# Altium schematic sheet MSP430.SchDoc
size A
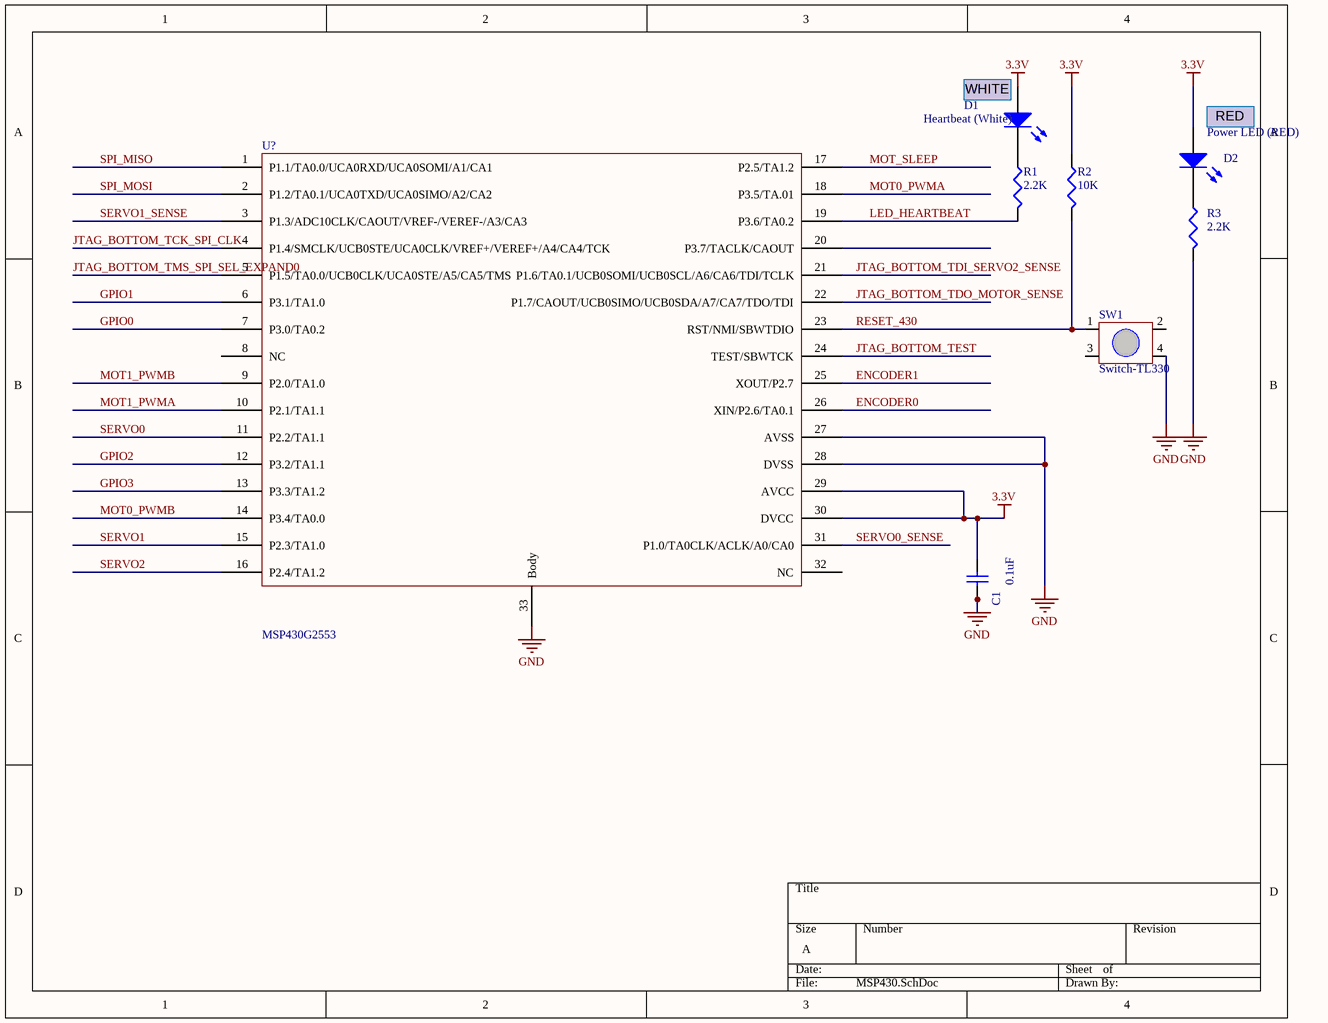
[diagram p0: MSP430.SchDoc]

## Parts
C1  value 0.1uF  [CAPC1005L]  (hidden comment: Cap Semi)
D1  Heartbeat (White)  [SurfaceMount(603)]
D2  Power LED (RED)  [SurfaceMount(603)]
R1  value 2.2K  [J1-0603]  (hidden comment: DiodeRes)
R2  value 10K  [J1-0603]  (hidden comment: ResetRes)
R3  value 2.2K  [J1-0603]  (hidden comment: DiodeRes)
SW1  Switch-TL330  [SwitchTall-TL330]
U?  MSP430G2553  [QFN-32]

## Nets
3.3V: C1.2 D1.1(A) D2.1(A) R2.1 U?.29(AVCC) U?.30(DVCC)
GND: C1.1 R3.2 SW1.4 U?.27(AVSS) U?.28(DVSS) U?.33(Body)
ENCODER0: U?.26(XIN/P2.6/TA0.1)
ENCODER1: U?.25(XOUT/P2.7)
GPIO0: U?.7(P3.0/TA0.2)
GPIO1: U?.6(P3.1/TA1.0)
GPIO2: U?.12(P3.2/TA1.1)
GPIO3: U?.13(P3.3/TA1.2)
JTAG_BOTTOM_TCK_SPI_CLK: U?.4(P1.4/SMCLK/UCB0STE/UCA0CLK/VREF+/VEREF+/A4/CA4/TCK)
JTAG_BOTTOM_TDI_SERVO2_SENSE: U?.21(P1.6/TA0.1/UCB0SOMI/UCB0SCL/A6/CA6/TDI/TCLK)
JTAG_BOTTOM_TDO_MOTOR_SENSE: U?.22(P1.7/CAOUT/UCB0SIMO/UCB0SDA/A7/CA7/TDO/TDI)
JTAG_BOTTOM_TEST: U?.24(TEST/SBWTCK)
JTAG_BOTTOM_TMS_SPI_SEL_EXPAND0: U?.5(P1.5/TA0.0/UCB0CLK/UCA0STE/A5/CA5/TMS)
LED_HEARTBEAT: R1.2 U?.19(P3.6/TA0.2)
MOT0_PWMA: U?.18(P3.5/TA.01)
MOT0_PWMB: U?.14(P3.4/TA0.0)
MOT1_PWMA: U?.10(P2.1/TA1.1)
MOT1_PWMB: U?.9(P2.0/TA1.0)
MOT_SLEEP: U?.17(P2.5/TA1.2)
RESET_430: R2.2 SW1.1 U?.23(RST/NMI/SBWTDIO)
SERVO0: U?.11(P2.2/TA1.1)
SERVO0_SENSE: U?.31(P1.0/TA0CLK/ACLK/A0/CA0)
SERVO1: U?.15(P2.3/TA1.0)
SERVO1_SENSE: U?.3(P1.3/ADC10CLK/CAOUT/VREF-/VEREF-/A3/CA3)
SERVO2: U?.16(P2.4/TA1.2)
SPI_MISO: U?.1(P1.1/TA0.0/UCA0RXD/UCA0SOMI/A1/CA1)
SPI_MOSI: U?.2(P1.2/TA0.1/UCA0TXD/UCA0SIMO/A2/CA2)
NetD1_2: D1.2(K) R1.1
NetD2_2: D2.2(K) R3.1

Not connected (* = marked no-connect by the designer): SW1 2 3; U? 8(NC) 20(P3.7/TACLK/CAOUT) 32(NC)

## Notes on the sheet
- (near D1) WHITE
- (near D2) RED

## Library data of the parts
C1 = Cap Semi: Capacitor (Semiconductor SIM Model); Published: 8-Jun-2000; LatestRevisionDate: 29-May-2009; LatestRevisionNote: IPC-7351 Footprint Added.; PackageReference: C1206; Publisher: Altium Limited; PackageDescription: Chip Capacitor
D1 D2 = LED
R1-R3 = Res3: Resistor; Published: 8-Jun-2000; LatestRevisionDate: 29-May-2009; LatestRevisionNote: IPC-7351 Footprint Added.; PackageReference: J1-0603; Publisher: Altium Limited; PackageDescription: Chip Resistor